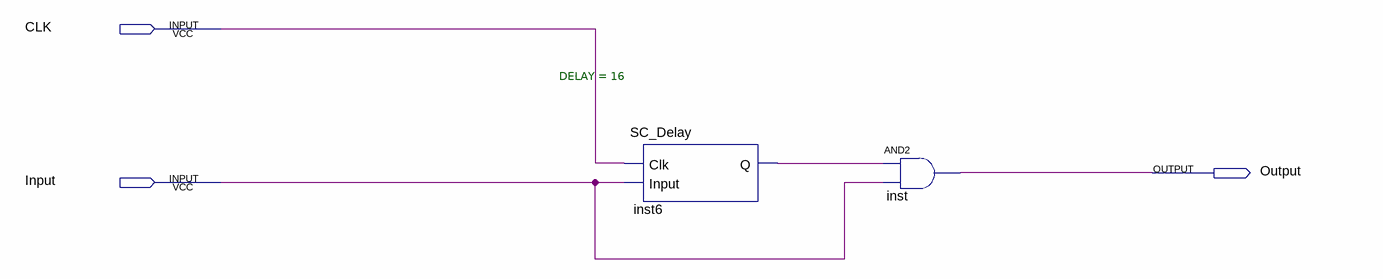
[diagram p0: schematic sheet]
// Quartus schematic SC_Self_AND.bdf as structural Verilog: 2 symbols, 3 pins
module SC_Self_AND (
  input  CLK,
  input  Input,
  output Output
);

  wire inst6_q;

  SC_Delay #(.DELAY(16)) inst6 (.Clk(CLK), .Input(Input), .Q(inst6_q));
  and inst (Output, inst6_q, Input);
endmodule
